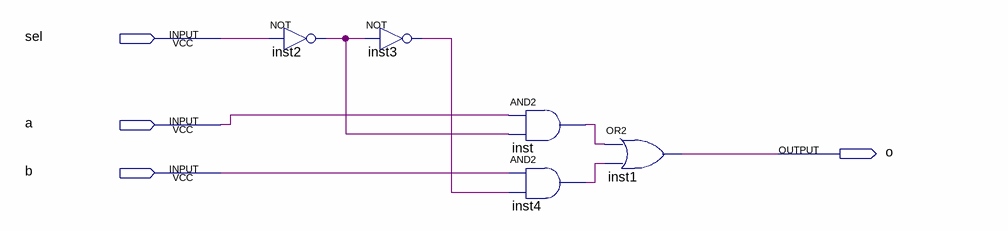
[diagram p0: schematic sheet]
// Quartus schematic MUX_2t1.bdf as structural Verilog: 5 symbols, 4 pins
module MUX_2t1 (
  input  sel,
  input  a,
  input  b,
  output o
);

  wire inst2_out, inst3_out, inst4_out, inst_out;

  not inst2 (inst2_out, sel);
  not inst3 (inst3_out, inst2_out);
  and inst (inst_out, a, inst2_out);
  and inst4 (inst4_out, b, inst3_out);
  or inst1 (o, inst_out, inst4_out);
endmodule
